# Altium schematic sheet MOTOR_DRV.SchDoc
size A3; SheetNumber: 2; SheetTotal: 5
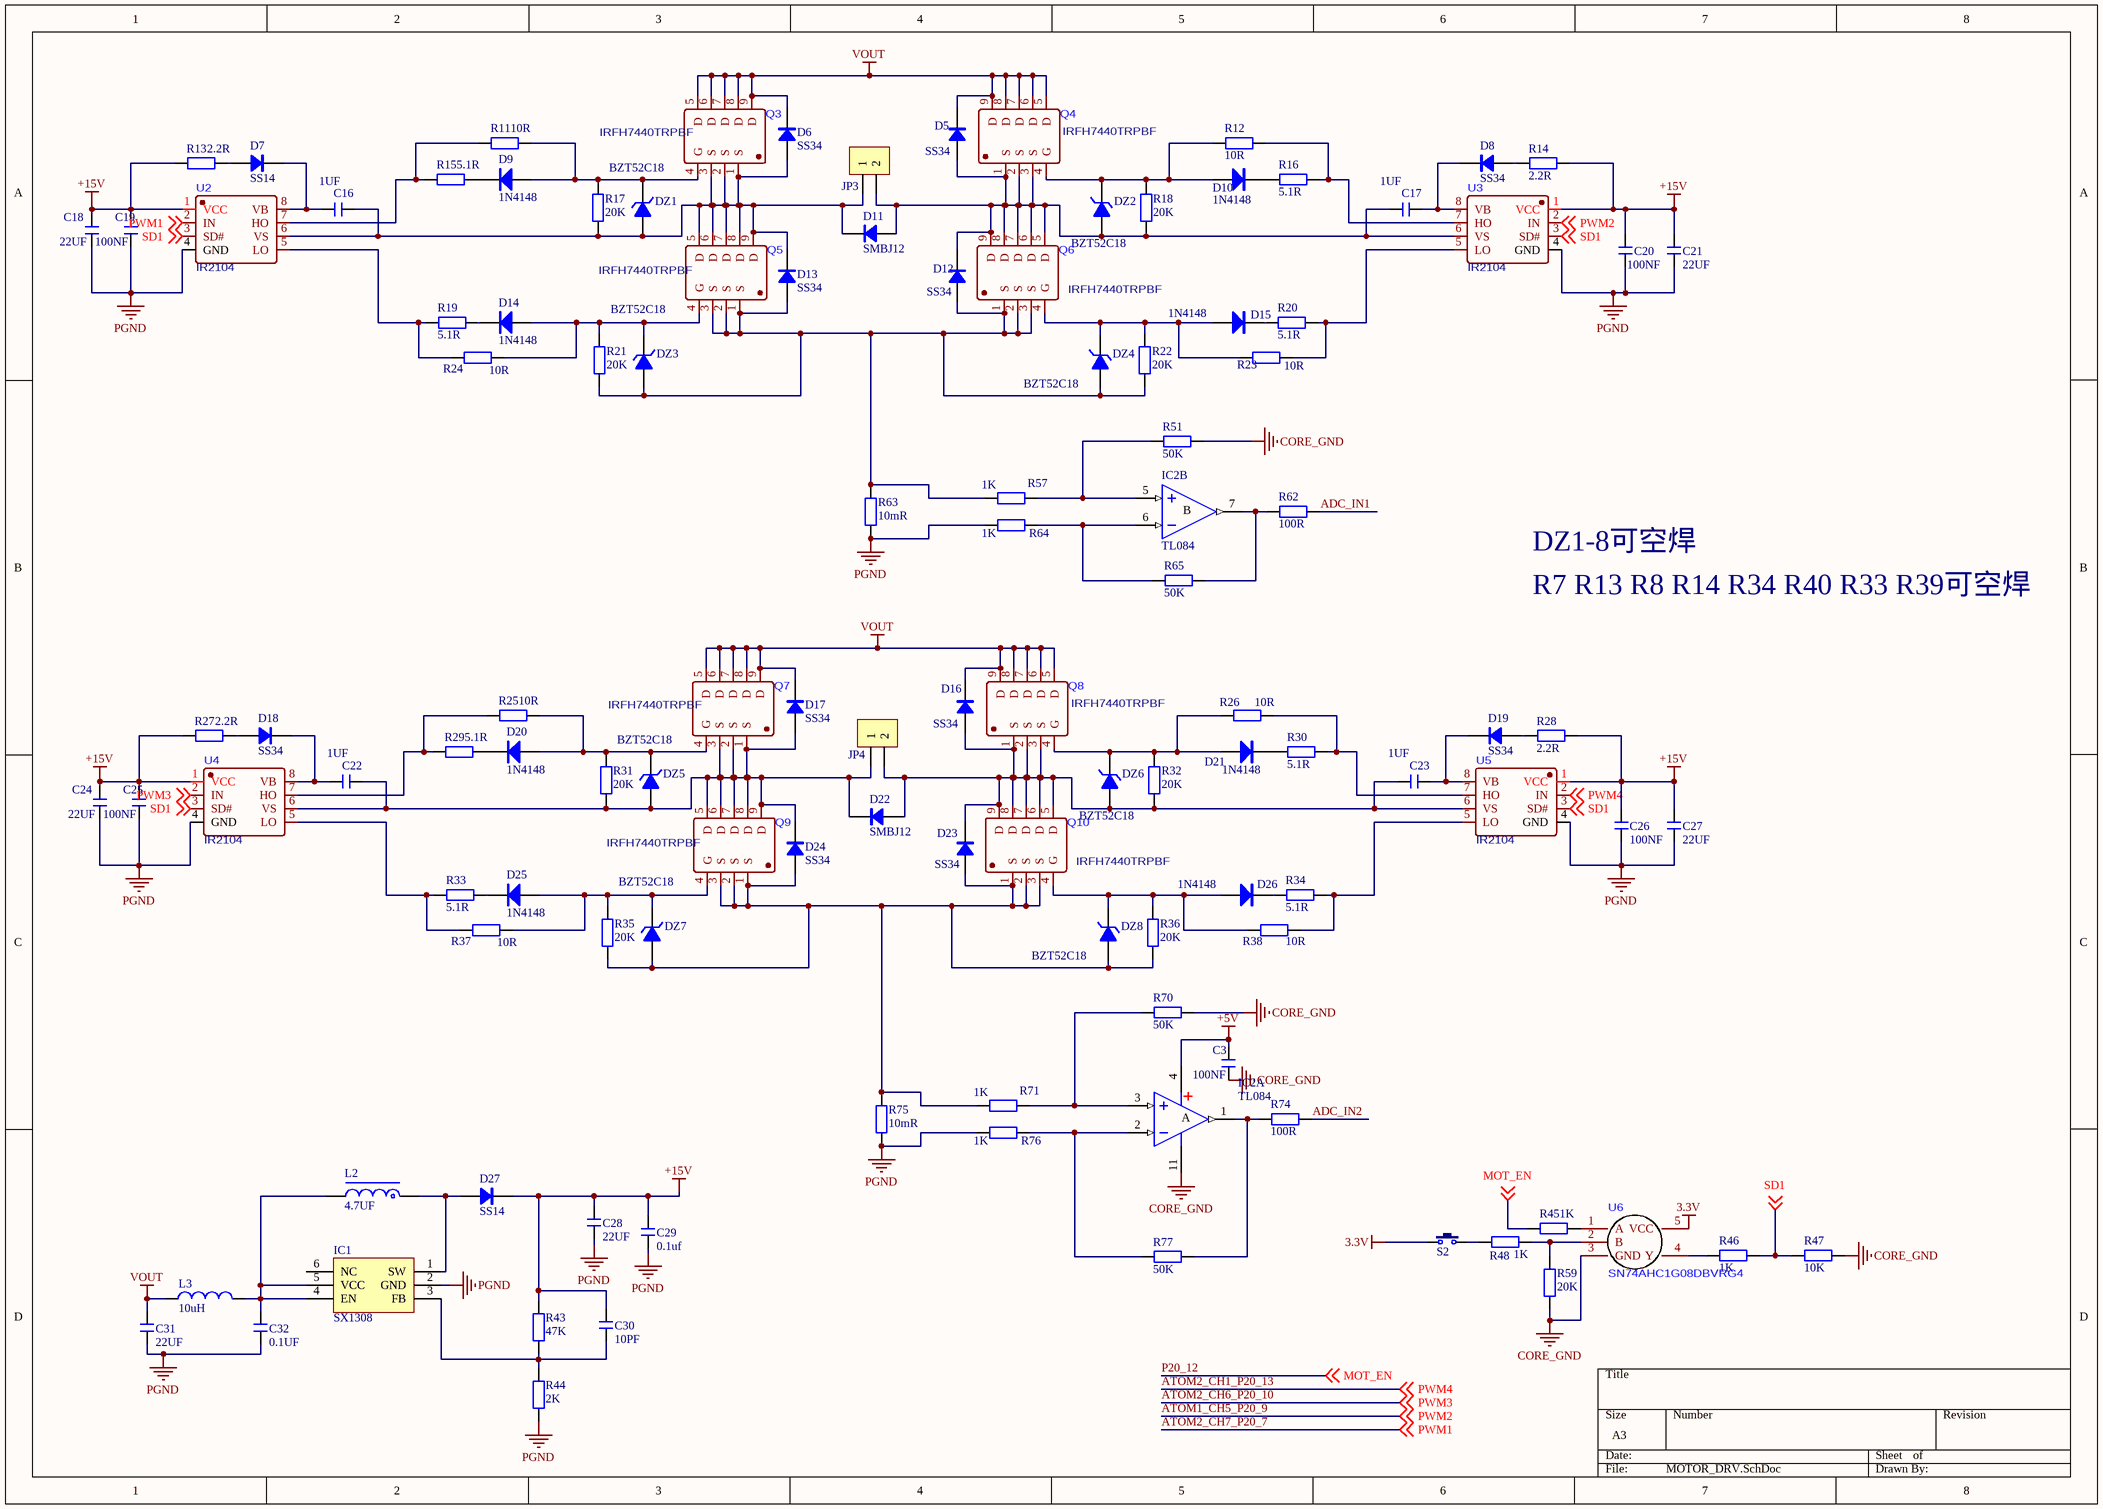
[diagram p0: MOTOR_DRV.SchDoc]

## Parts
C3  100NF  [C 0805_L]
C16  1UF  [C 1206_L]
C17  1UF  [C 1206_L]
C18  22UF  [C 0805_L]
C19  100NF  [C 0805_L]
C20  100NF  [C 0805_L]
C21  22UF  [C 0805_L]
C22  1UF  [C 1206_L]
C23  1UF  [C 1206_L]
C24  22UF  [C 0805_L]
C25  100NF  [C 0805_L]
C26  100NF  [C 0805_L]
C27  22UF  [C 0805_L]
C28  22UF  [C 1206_L]
C29  0.1uf  [C 0805_L]
C30  10PF  [C 0603_L]
C31  22UF  [C 1206_L]
C32  0.1UF  [C 0805_L]
D5  SS34  [SMA]
D6  SS34  [SMA]
D7  SS14  [SOD-123]
D8  SS34  [SOD-123]
D9  1N4148  [SOD-323]
D10  1N4148  [SOD-323]
D11  SMBJ12  [SMA]
D12  SS34  [SMA]
D13  SS34  [SMA]
D14  1N4148  [SOD-323]
D15  1N4148  [SOD-323]
D16  SS34  [SMA]
D17  SS34  [SMA]
D18  SS34  [SOD-123]
D19  SS34  [SOD-123]
D20  1N4148  [SOD-323]
D21  1N4148  [SOD-323]
D22  SMBJ12  [SMA]
D23  SS34  [SMA]
D24  SS34  [SMA]
D25  1N4148  [SOD-323]
D26  1N4148  [SOD-323]
D27  SS14  [SOD-123]
DZ1  BZT52C18  [SOD-323]
DZ2  BZT52C18  [SOD-323]
DZ3  BZT52C18  [SOD-323]
DZ4  BZT52C18  [SOD-323]
DZ5  BZT52C18  [SOD-323]
DZ6  BZT52C18  [SOD-323]
DZ7  BZT52C18  [SOD-323]
DZ8  BZT52C18  [SOD-323]
IC1  SX1308  [SOT23-6N]
IC2  TL084  [SOP14_N]  (parts A,B of 4)
JP3  HDR-1X2  [KF2EDGK5.08-LI-2P]  (value not drawn)
JP4  HDR-1X2  [KF2EDGK5.08-LI-2P]  (value not drawn)
L2  4.7UF  [L-SMD-0420]
L3  10uH  [L 0805_L]
Q3  IRFH7440TRPBF  [PQFN-8P_L5.8-W4.9-P1.27-LS6.0-BL]
Q4  IRFH7440TRPBF  [PQFN-8P_L5.8-W4.9-P1.27-LS6.0-BL]
Q5  IRFH7440TRPBF  [PQFN-8P_L5.8-W4.9-P1.27-LS6.0-BL]
Q6  IRFH7440TRPBF  [PQFN-8P_L5.8-W4.9-P1.27-LS6.0-BL]
Q7  IRFH7440TRPBF  [PQFN-8P_L5.8-W4.9-P1.27-LS6.0-BL]
Q8  IRFH7440TRPBF  [PQFN-8P_L5.8-W4.9-P1.27-LS6.0-BL]
Q9  IRFH7440TRPBF  [PQFN-8P_L5.8-W4.9-P1.27-LS6.0-BL]
Q10  IRFH7440TRPBF  [PQFN-8P_L5.8-W4.9-P1.27-LS6.0-BL]
R11  10R  [R 0805_L]
R12  10R  [R 0805_L]
R13  2.2R  [R 0805_L]
R14  2.2R  [R 0805_L]
R15  5.1R  [R 0805_L]
R16  5.1R  [R 0805_L]
R17  20K  [R 0805_L]
R18  20K  [R 0805_L]
R19  5.1R  [R 0805_L]
R20  5.1R  [R 0805_L]
R21  20K  [R 0805_L]
R22  20K  [R 0805_L]
R23  10R  [R 0805_L]
R24  10R  [R 0805_L]
R25  10R  [R 0805_L]
R26  10R  [R 0805_L]
R27  2.2R  [R 0805_L]
R28  2.2R  [R 0805_L]
R29  5.1R  [R 0805_L]
R30  5.1R  [R 0805_L]
R31  20K  [R 0805_L]
R32  20K  [R 0805_L]
R33  5.1R  [R 0805_L]
R34  5.1R  [R 0805_L]
R35  20K  [R 0805_L]
R36  20K  [R 0805_L]
R37  10R  [R 0805_L]
R38  10R  [R 0805_L]
R43  47K  [R 0805_L]
R44  2K  [R 0805_L]
R45  1K  [R 0805_L]
R46  1K  [R 0805_L]
R47  10K  [R 0805_L]
R48  1K  [R 0805_L]
R51  50K  [R 0805_L]
R57  1K  [R 0805_L]
R59  20K  [R 0805_L]
R62  100R  [R 0805_L]
R63  10mR  [R 2512_M]
R64  1K  [R 0805_L]
R65  50K  [R 0805_L]
R70  50K  [R 0805_L]
R71  1K  [R 0805_L]
R74  100R  [R 0805_L]
R75  10mR  [R 2512_M]
R76  1K  [R 0805_L]
R77  50K  [R 0805_L]
S2  6x6x5  [KEY-TH_CN-KCD11]  (value not drawn)
U2  IR2104  [SOP8_M]
U3  IR2104  [SOP8_M]
U4  IR2104  [SOP8_M]
U5  IR2104  [SOP8_M]
U6  SN74AHC1G08DBVRG4  [SOT23-5L]

## Nets
3.3V: S2.1 U6.5(VCC)
+5V: C3.2 IC2.4(V+)
+15V: C18.2 C19.2 C20.2 C21.2 C24.2 C25.2 C26.2 C27.2 C28.1 C29.1 C30.1 D27.2(K) R13.1 R14.1 R27.1 R28.1 R43.1 U2.1(VCC) U3.1(VCC) U4.1(VCC) U5.1(VCC)
CORE_GND: C3.1 IC2.11(V-) R47.2 R51.1 R59.2 R70.1 U6.3(GND)
PGND: C18.1 C19.1 C20.1 C21.1 C24.1 C25.1 C26.1 C27.1 C28.2 C29.2 C31.2 C32.2 IC1.2(GND) R44.2 R63.1 R64.2 R75.1 R76.2 U2.4(GND) U3.4(GND) U4.4(GND) U5.4(GND)
VOUT: C31.1 D5.2(K) D6.2(K) D16.2(K) D17.2(K) L3.1 Q3.5(D) Q3.6(D) Q3.7(D) Q3.8(D) Q3.9(D) Q4.5(D) Q4.6(D) Q4.7(D) Q4.8(D) Q4.9(D) Q7.5(D) Q7.6(D) Q7.7(D) Q7.8(D) Q7.9(D) Q8.5(D) Q8.6(D) Q8.7(D) Q8.8(D) Q8.9(D)
ADC_IN1: R62.1
ADC_IN2: R74.1
ATOM1_CH5_P20_9: U3.2(IN) ; off-sheet PWM2  [also labelled PWM2]
ATOM2_CH1_P20_13: U5.2(IN) ; off-sheet PWM4  [also labelled PWM4]
ATOM2_CH6_P20_10: U4.2(IN) ; off-sheet PWM3  [also labelled PWM3]
ATOM2_CH7_P20_7: U2.2(IN) ; off-sheet PWM1  [also labelled PWM1]
P20_12: R45.2 ; off-sheet MOT_EN  [also labelled MOT_EN]
SD1: R46.2 R47.1 U2.3(SD#) U3.3(SD#) U4.3(SD#) U5.3(SD#) ; off-sheet SD1
NetC16_1: C16.1 D6.1(A) D11.2(K) D13.2(K) DZ1.1(A) JP3.1 Q3.1(S) Q3.2(S) Q3.3(S) Q5.5(D) Q5.6(D) Q5.7(D) Q5.8(D) Q5.9(D) R17.1 U2.6(VS)
NetC16_2: C16.2 D7.2(K) U2.8(VB)
NetC17_1: C17.1 D5.1(A) D11.1(A) D12.2(K) DZ2.1(A) JP3.2 Q4.1(S) Q4.2(S) Q4.3(S) Q6.5(D) Q6.6(D) Q6.7(D) Q6.8(D) Q6.9(D) R18.1 U3.6(VS)
NetC17_2: C17.2 D8.2(K) U3.8(VB)
NetC22_1: C22.1 D17.1(A) D22.2(K) D24.2(K) DZ5.1(A) JP4.1 Q7.1(S) Q7.2(S) Q7.3(S) Q9.5(D) Q9.6(D) Q9.7(D) Q9.8(D) Q9.9(D) R31.1 U4.6(VS)
NetC22_2: C22.2 D18.2(K) U4.8(VB)
NetC23_1: C23.1 D16.1(A) D22.1(A) D23.2(K) DZ6.1(A) JP4.2 Q8.1(S) Q8.2(S) Q8.3(S) Q10.5(D) Q10.6(D) Q10.7(D) Q10.8(D) Q10.9(D) R32.1 U5.6(VS)
NetC23_2: C23.2 D19.2(K) U5.8(VB)
NetC30_2: C30.2 IC1.3(FB) R43.2 R44.1
NetC32_1: C32.1 IC1.4(EN) IC1.5(VCC) L2.2 L3.2
NetD7_1: D7.1(A) R13.2
NetD8_1: D8.1(A) R14.2
NetD9_1: D9.1(A) DZ1.2(K) Q3.4(G) R11.2 R17.2
NetD9_2: D9.2(K) R15.2
NetD10_1: D10.1(A) DZ2.2(K) Q4.4(G) R12.2 R18.2
NetD10_2: D10.2(K) R16.2
NetD12_1: D12.1(A) D13.1(A) DZ3.1(A) DZ4.1(A) Q5.1(S) Q5.2(S) Q5.3(S) Q6.1(S) Q6.2(S) Q6.3(S) R21.1 R22.1 R57.2 R63.2
NetD14_1: D14.1(A) DZ3.2(K) Q5.4(G) R21.2 R24.2
NetD14_2: D14.2(K) R19.2
NetD15_1: D15.1(A) DZ4.2(K) Q6.4(G) R22.2 R23.2
NetD15_2: D15.2(K) R20.2
NetD18_1: D18.1(A) R27.2
NetD19_1: D19.1(A) R28.2
NetD20_1: D20.1(A) DZ5.2(K) Q7.4(G) R25.2 R31.2
NetD20_2: D20.2(K) R29.2
NetD21_1: D21.1(A) DZ6.2(K) Q8.4(G) R26.2 R32.2
NetD21_2: D21.2(K) R30.2
NetD23_1: D23.1(A) D24.1(A) DZ7.1(A) DZ8.1(A) Q9.1(S) Q9.2(S) Q9.3(S) Q10.1(S) Q10.2(S) Q10.3(S) R35.1 R36.1 R71.2 R75.2
NetD25_1: D25.1(A) DZ7.2(K) Q9.4(G) R35.2 R37.2
NetD25_2: D25.2(K) R33.2
NetD26_1: D26.1(A) DZ8.2(K) Q10.4(G) R36.2 R38.2
NetD26_2: D26.2(K) R34.2
NetD27_1: D27.1(A) IC1.1(SW) L2.1
NetIC2_1: IC2.1(OUT) R74.2 R77.1
NetIC2_2: IC2.2(IN-) R76.1 R77.2
NetIC2_3: IC2.3(IN+) R70.2 R71.1
NetIC2_5: IC2.5(IN+) R51.2 R57.1
NetIC2_6: IC2.6(IN-) R64.1 R65.2
NetIC2_7: IC2.7(OUT) R62.2 R65.1
NetR11_1: R11.1 R15.1 U2.7(HO)
NetR12_1: R12.1 R16.1 U3.7(HO)
NetR19_1: R19.1 R24.1 U2.5(LO)
NetR20_1: R20.1 R23.1 U3.5(LO)
NetR25_1: R25.1 R29.1 U4.7(HO)
NetR26_1: R26.1 R30.1 U5.7(HO)
NetR33_1: R33.1 R37.1 U4.5(LO)
NetR34_1: R34.1 R38.1 U5.5(LO)
NetR45_1: R45.1 U6.1(A)
NetR46_1: R46.1 U6.4(Y)
NetR48_1: R48.1 R59.1 U6.2(B)
NetR48_2: R48.2 S2.2

Not connected (* = marked no-connect by the designer): IC1 6(NC)

## Notes on the sheet
- DZ1-8可空焊
- R7 R13 R8 R14 R34 R40 R33 R39可空焊
- (in symbol TL084, part A) A
- (in symbol TL084, part B) B

## Library data of the parts
C3 C16-C32 = C: 无极性贴片电容; 版权归属: 源创客; 材质: X7R; BOM名称: 无极性贴片电容; 学习资源: www.ooocke.com
D5-D8 D11-D13 D16-D19 D22-D24 = SS34: 肖特基二极管; 版权归属: 源创客; 属性: 40V/3A; BOM名称: 肖特基二极管; 学习资源: www.ooocke.com
D9 D10 D14 D15 D20 D21 D25 D26 = 1N4148: 高速开关二极管; 版权归属: 源创客; BOM名称: 高速开关二极管; 学习资源: www.ooocke.com
D27 = SS24: 肖特基二极管; 版权归属: 源创客; 属性: 40V/2A; BOM名称: 肖特基二极管; 学习资源: www.ooocke.com
DZ1-DZ8 = 1N4102: 18V稳压管; BOM名称: 8.7V/0.5W稳压管; 版权归属: 源创客; 学习资源: www.ooocke.com
IC1 = SX1308: 可调升压芯片; 版权归属: 源创客; BOM名称: 可调升压芯片; 学习资源: www.ooocke.com
IC2 = TL084: 4路运放; 版权归属: 源创客; BOM名称: 4路运放; 学习资源: www.ooocke.com
JP3 JP4 = Header 2: 2P接插件; 版权归属: 源创客; BOM名称: 2P接插件; 学习资源: www.ooocke.com
L2 = L-CDRH: 功率屏蔽电感; 版权归属: 源创客; BOM名称: 功率屏蔽电感; 学习资源: www.ooocke.com
L3 = L: 小功率贴片电感; 版权归属: 源创客; BOM名称: 小功率贴片电感; 学习资源: www.ooocke.com
R11-R38 R43-R48 R51 R57 R59 R62-R65 R70 R71 R74-R77 = R: 贴片电阻; 版权归属: 源创客; BOM名称: 贴片电阻; 学习资源: www.ooocke.com
S2 = TSW DIP-2Pin-6x6: 2脚直插6x6轻触开关; BOM名称: 2脚轻触开关; 版权归属: 源创客; 学习资源: www.ooocke.com
U2-U5 = EG2104